# EAGLE design Port Expander (EAGLE 7.2.0)
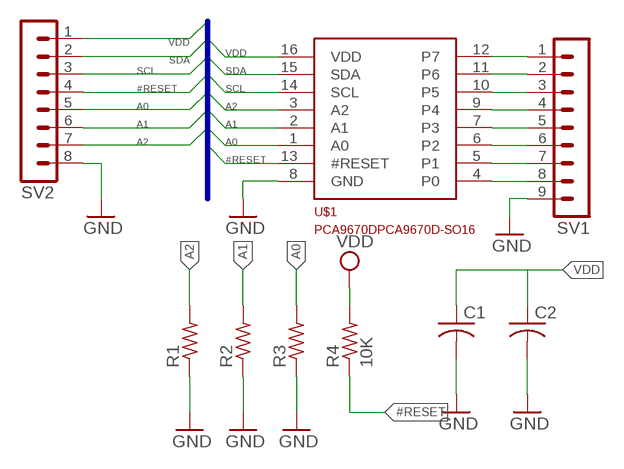
[diagram p0: schematic, sheet 1]

## Parts
C1  C-USC1210  [C1210]
C2  C-USC1206  [C1206]
R1  R-US_R1206  [R1206]
R2  R-US_R1206  [R1206]
R3  R-US_R1206  [R1206]
R4  10K  R-US_M1206  [M1206]
SV1  MA09-1  [MA09-1]
SV2  MA08-1  [MA08-1]
U$1  PCA9670DPCA9670D-SO16  [PCA9670D-SO16]

## Nets
#RESET: R4.1 SV2.4 U$1.13(#RESET)
A0: R3.2 SV2.5 U$1.1(A0)
A1: R2.2 SV2.6 U$1.2(A1)
A2: R1.2 SV2.7 U$1.3(A2)
GND: C1.2 C2.2 R1.1 R2.1 R3.1 SV1.9 SV2.8 U$1.8(GND)
N$1: SV1.1 U$1.12(P7)
N$2: SV1.2 U$1.11(P6)
N$3: SV1.3 U$1.10(P5)
N$4: SV1.4 U$1.9(P4)
N$5: SV1.5 U$1.7(P3)
N$6: SV1.6 U$1.6(P2)
N$7: SV1.7 U$1.5(P1)
N$8: SV1.8 U$1.4(P0)
SCL: SV2.3 U$1.14(SCL)
SDA: SV2.2 U$1.15(SDA)
VDD: C1.1 C2.1 R4.2 SV2.1 U$1.16(VDD)

## Buses
VDD,SDA,SCL,A2,A1,A0,#RESET,GND

## Library data of the parts
C1 C2 = resistor:C-US: CAPACITOR, American symbol
R1-R4 = rcl:R-US_: RESISTOR, American symbol
SV1 = con-lstb:MA09-1: PIN HEADER; OC_FARNELL: unknown; OC_NEWARK: unknown
SV2 = con-lstb:MA08-1: PIN HEADER; OC_FARNELL: unknown; OC_NEWARK: unknown
U$1 = HCloudLib:PCA9670D

## Board
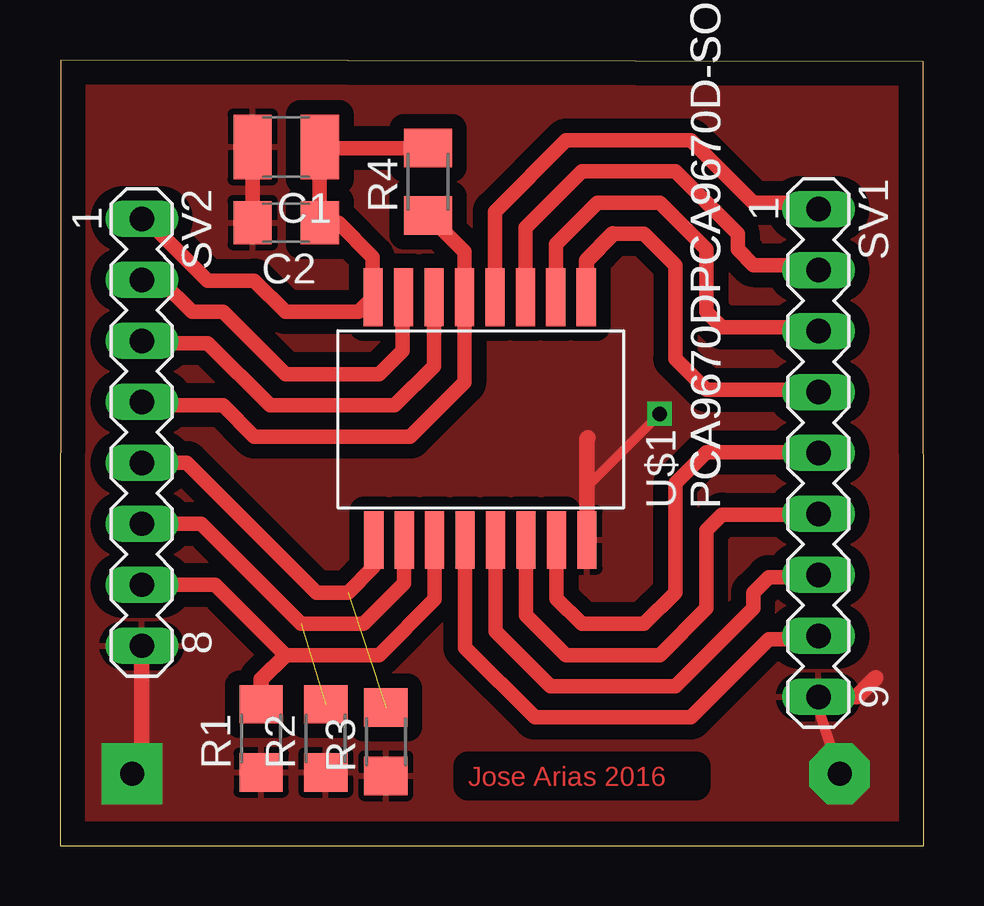
[diagram p1: board, top side]
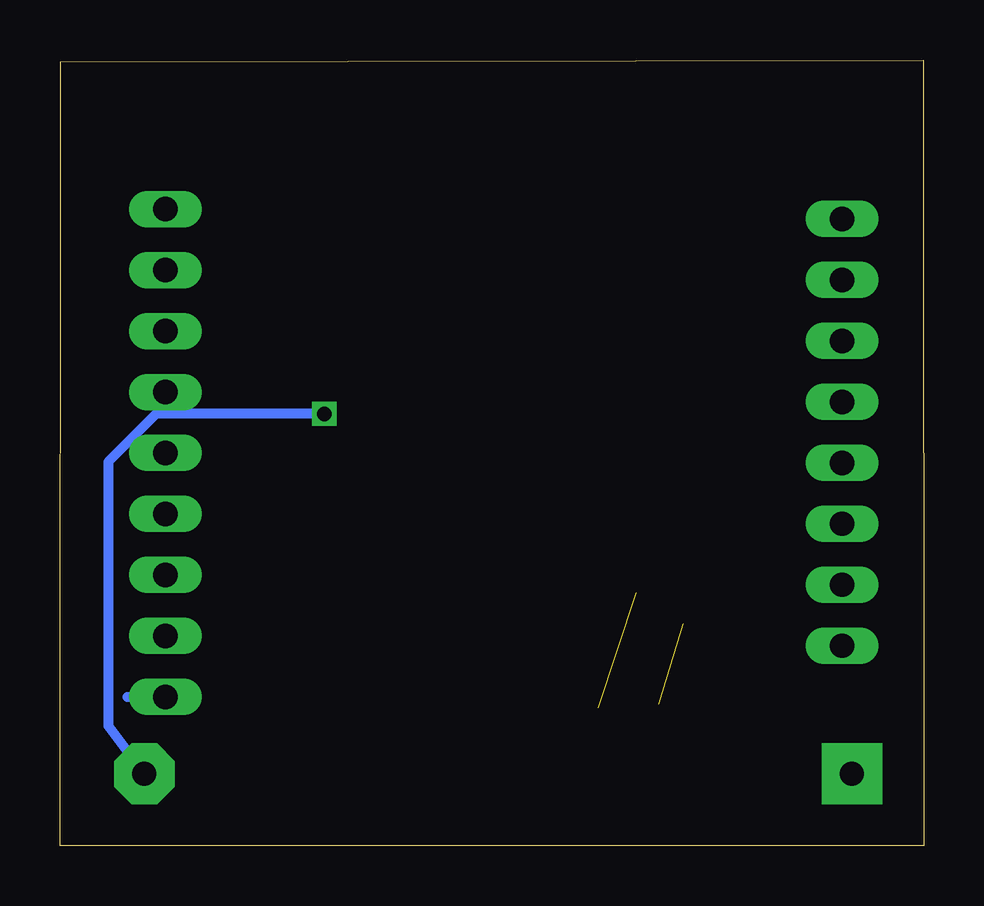
[diagram p2: board, bottom side, seen from below]

Size 36.02 x 32.74 mm. Coordinates in mm from the lower left corner, seen from the top.
Outline: 0,0 36.02,0 35.98,32.68 0.03,32.74 0,0
Copper layers (1*16): Top 0.035mm / dielectric 1.5mm / Bottom 0.035mm
Design rules "default": minimum track width 10mil, minimum drill 24mil, track to track 8mil, track to pad 8mil, pad to pad 8mil, via to via 8mil, smd to smd 8mil, copper to edge 40mil, drill to drill 8mil, minimum pad ring 10mil, minimum via ring 8mil, stop-mask expansion 4mil, vias tented up to drill 0mil, thermal gap 10mil

### Footprints (pad centres in the part's own frame; a part is rotated, then mirrored left to right if it is on the bottom)
C1210 = smd 1.6 x 2.7: 1 -1.4,0; 2 1.4,0
C1206 = smd 1.6 x 1.8: 1 -1.4,0; 2 1.4,0
R1206 = smd 1.6 x 1.803: 1 -1.422,0; 2 1.422,0
M1206 = smd 1.6 x 2: 1 -1.4,0; 2 1.4,0
MA09-1 = drill 1.016 long: 1 -10.16,0; 2 -7.62,0; 3 -5.08,0; 4 -2.54,0; 5 0,0; 6 2.54,0; 7 5.08,0; 8 7.62,0; 9 10.16,0
MA08-1 = drill 1.016 long: 1 -8.89,0; 2 -6.35,0; 3 -3.81,0; 4 -1.27,0; 5 1.27,0; 6 3.81,0; 7 6.35,0; 8 8.89,0
PCA9670D-SO16 = smd 2.4 x 0.8: 1 -5.02,4.46; 2 -5.02,3.19; 3 -5.02,1.92; 4 -5.02,0.65; 5 -5.02,-0.62; 6 -5.02,-1.89; 7 -5.02,-3.16; 8 -5.02,-4.43; 9 5.09,-4.4; 10 5.09,-3.13; 11 5.09,-1.86; 12 5.09,-0.59; 13 5.09,0.68; 14 5.09,1.95; 15 5.09,3.22; 16 5.09,4.49

### Placement (x,y rotation side)
C1  9.43,29.12 180 top
C2  9.43,25.96 180 top
R1  8.39,4.48 90 top
R2  11.08,4.48 90 top
R3  13.59,4.34 90 top
R4  15.34,27.67 90 top
SV1  31.62,16.37 270 top
SV2  3.41,17.23 270 top
U$1  17.54,17.77 90 top

### Tracks (layer width: path | path; a pad name or v marks a point on that pad's centre or on a via)
#RESET
  Top 0.61: SV2.4 3.56,18.35 6.8,18.35 8.1,17.05 14.6,17.05 16.86,19.31 U$1.13 16.86,24.75 R4.1
A0  (1 unrouted)
  Top 0.61: U$1.1 13.08,11.63 12,10.55 10.7,10.55 5.29,15.96 SV2.5
A1  (1 unrouted)
  Top 0.61: U$1.2 14.35,10.95 12.65,9.25 10.05,9.25 5.88,13.42 SV2.6
A2
  Top 0.61: U$1.3 15.62,10.27 13.3,7.95 9.4,7.95 6.47,10.88 SV2.7
  Top 0.65: R1.2 8.39,6.94 9.4,7.95
GND  (via drill 0.6, 1 pad 2.54)
  Top 0.406: U$1.8 21.97,14.97 v25,18 | v32.5,3 31.5,6.09 SV1.9
  Top 0.61: C1.2 C2.2
  Top 0.65: U$1.8 21.97,16.97 22,17 | SV1.9 33.21,6.21 34,7 | SV2.8 3.41,3.41 v3,3
  Bottom 0.406: v25,18 32,18 34,16 34,5 v32.5,3 | 33.21,6.21 SV1.9
  pour Top (isolate 0.61): 0,32.5 36,32.5 36,0 0,0
N$1
  Top 0.61: U$1.12 18.13,26.43 21.1,29.4 26.3,29.4 28.9,26.8 31.35,26.8 SV1.1
N$2
  Top 0.61: U$1.11 19.4,25.75 21.75,28.1 25.65,28.1 28.25,25.5 28.25,24.85 28.9,24.2 31.41,24.2 SV1.2
N$3
  Top 0.61: U$1.10 20.67,25.07 22.4,26.8 25,26.8 26.95,24.85 26.95,22.25 27.6,21.6 31.47,21.6 SV1.3
N$4
  Top 0.61: 23.05,25.5 24.35,25.5 25.65,24.2 25.65,20.3 26.95,19 31.53,19 SV1.4
  Top 0.65: U$1.9 21.94,24.39 23.05,25.5
N$5
  Top 0.61: U$1.7 20.7,10.3 21.75,9.25 24.35,9.25 25.65,10.55 25.65,15.1 26.95,16.4 31.59,16.4 SV1.5
N$6
  Top 0.61: U$1.6 19.43,9.62 21.1,7.95 25,7.95 26.95,9.9 26.95,13.15 27.6,13.8 31.59,13.8 SV1.6
N$7
  Top 0.61: U$1.5 18.16,8.94 20.45,6.65 25.65,6.65 28.9,9.9 28.9,10.55 29.55,11.2 31.53,11.2 SV1.7
N$8
  Top 0.61: U$1.4 16.89,8.26 19.8,5.35 26.3,5.35 29.55,8.6 31.47,8.6 SV1.8
SCL
  Top 0.61: U$1.14 15.59,19.99 13.95,18.35 8.75,18.35 6.15,20.95 3.5,20.95 SV2.3
SDA
  Top 0.61: U$1.15 14.28,22.82 14.28,20.62 13.3,19.65 9.4,19.65 6.8,22.25 5.5,22.25 4.2,23.55 3.44,23.55 SV2.2
VDD
  Top 0.61: SV2.1 3.58,26.12 6.15,23.55 8.1,23.55 9.4,22.25 12.44,22.25 U$1.16 13.04,24.52 11.61,25.96 C2.1 C1.1 10.88,29.07 R4.2

### Text on the board
Top: Jose Arias 2016